# EAGLE schematic V4-HMModUART-V001 (EAGLE 9.3.0)
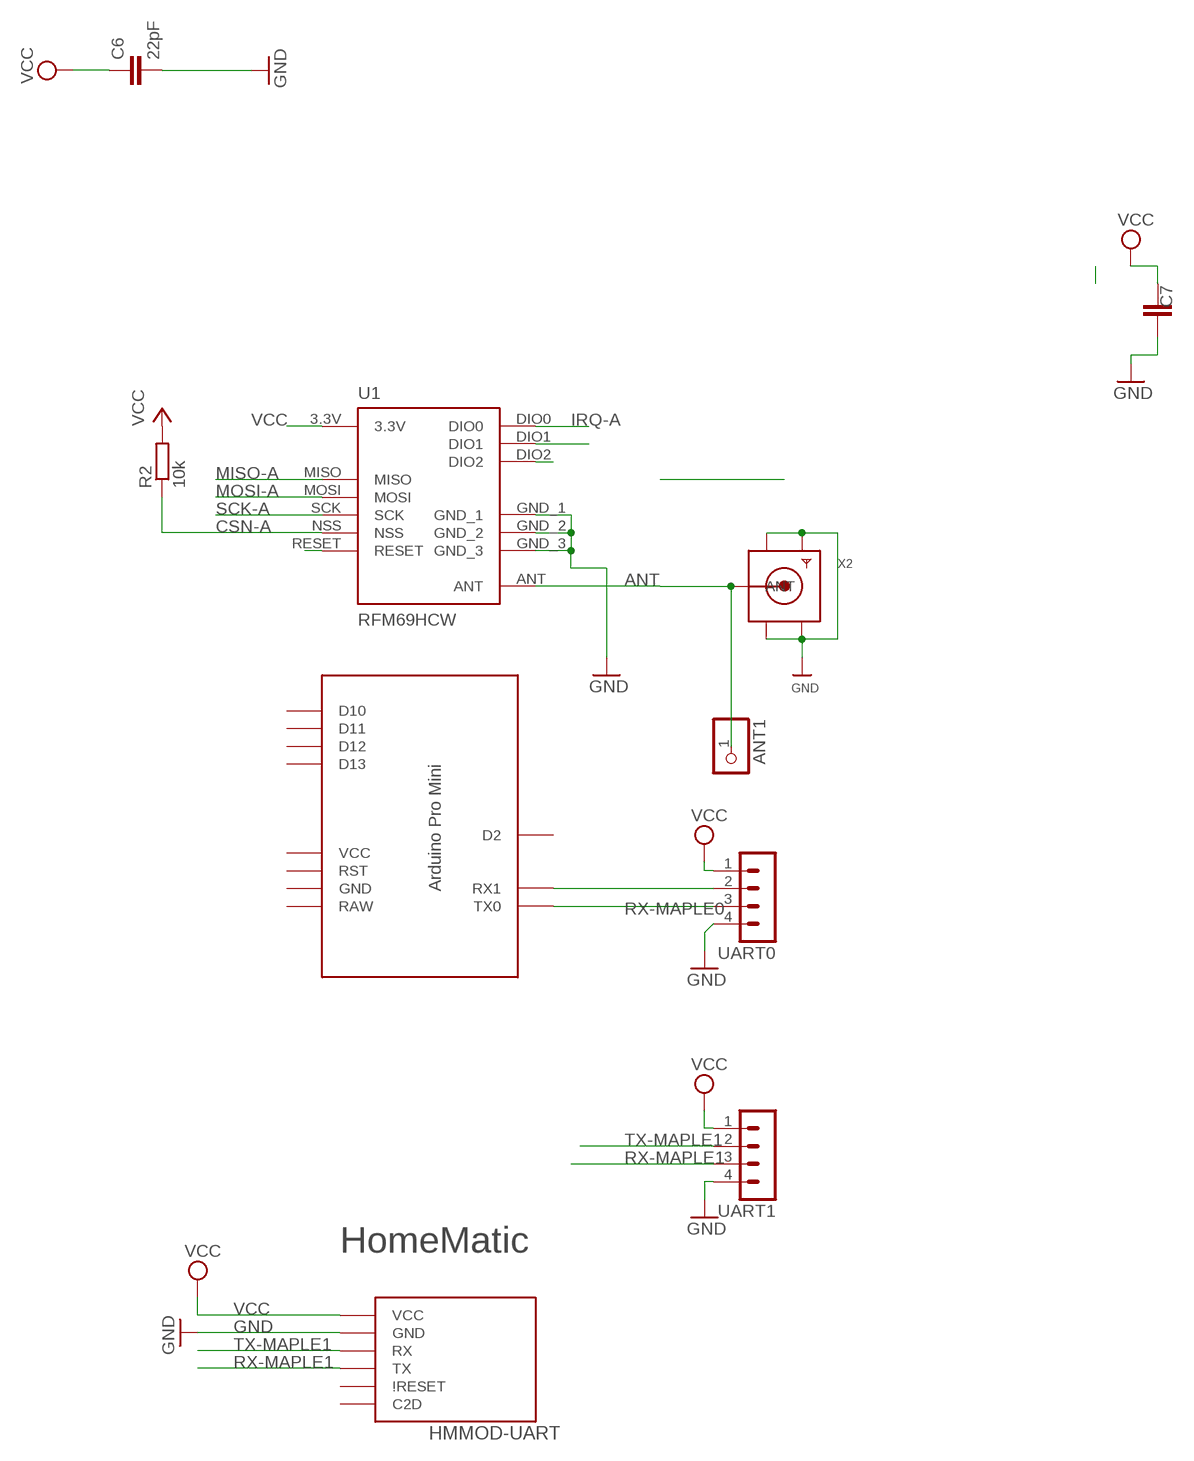
[diagram p0: schematic, sheet 1]

## Parts
ANT1  PINHD-1X1  [1X01]
C6  22pF  C-EUC0805  [C0805]
C7  C-EUC1812  [C1812]
HMMOD-UART  HM-MOD-UARTDIL  [HM-MOD-UART-DIL]
R2  10k  R-EU_M0805  [M0805]
U1  RFM69HCW  [RFM69HCW-XXXS2]
U$1  MARTIN-PROMINI-SPI  [MARTIN-PRO-SPI]
UART0  MA04-1  [MA04-1]
UART1  MA04-1  [MA04-1]
X2  SMACONNECTOR_EDGE  [SMA_EDGELAUNCH]

## Nets
ANT: U1.ANT
ANT1: ANT1.1 X2.P(ANT)
CSN-A: R2.1 U1.NSS
GND [PWR]: C6.2 C7.1 HMMOD-UART.2(GND) U1.GND_1 U1.GND_2 U1.GND_3 UART0.4 UART1.4 X2.GND@1(GND4) X2.GND@2(GND3) X2.GND@3(GND2) X2.GND@4(GND1)
IRQ-A: U1.DIO0
MISO-A: U1.MISO
MOSI-A: U1.MOSI
N$2: U$1.RX1 UART0.2
N$3: U1.RESET
N$14: U1.DIO2
N$15: U1.DIO1
RX-MAPLE0: U$1.TX0 UART0.3
RX-MAPLE1: HMMOD-UART.5(TX) UART1.3
SCK-A: U1.SCK
TX-MAPLE1: HMMOD-UART.6(RX) UART1.2
VCC [PWR]: C6.1 C7.2 HMMOD-UART.1(VCC) R2.2 U1.3.3V UART0.1 UART1.1
Unconnected: HMMOD-UART.3(C2D) HMMOD-UART.4(\!RESET) U$1.D2 U$1.D10 U$1.D11 U$1.D12 U$1.D13 U$1.GND U$1.RAW U$1.RST U$1.VCC

## Notes on the sheet
- HomeMatic

## Library data of the parts
ANT1 = pinhead:PINHD-1X1: PIN HEADER
C6 C7 = rcl:C-EU: CAPACITOR, European symbol; SPICEPREFIX: C
HMMOD-UART = wireless:HM-MOD-UART: eQ3 HM-MOD-UART-AW-SH2 wireless module for 868 MHz. DIL version for mounting with pin header (antenna upwards) and SMD variant available (antenna downwards).
R2 = rcl:R-EU_: RESISTOR, European symbol
U1 = doug:RFM69H
U$1 = Arduino-clone:MARTIN-PROMINI-SPI
UART0 UART1 = con-lstb:MA04-1: PIN HEADER; OC_FARNELL: unknown; OC_NEWARK: unknown
X2 = adafruit:SMACONNECTOR: SMA Connector 90° DIP SMA Connector, 50 Ohm (4UConnector: 07259)

## Net classes
0 default: width 0.305 mm
1 PWR: width 0.457 mm